# Altium project SmartBike.PrjPcb
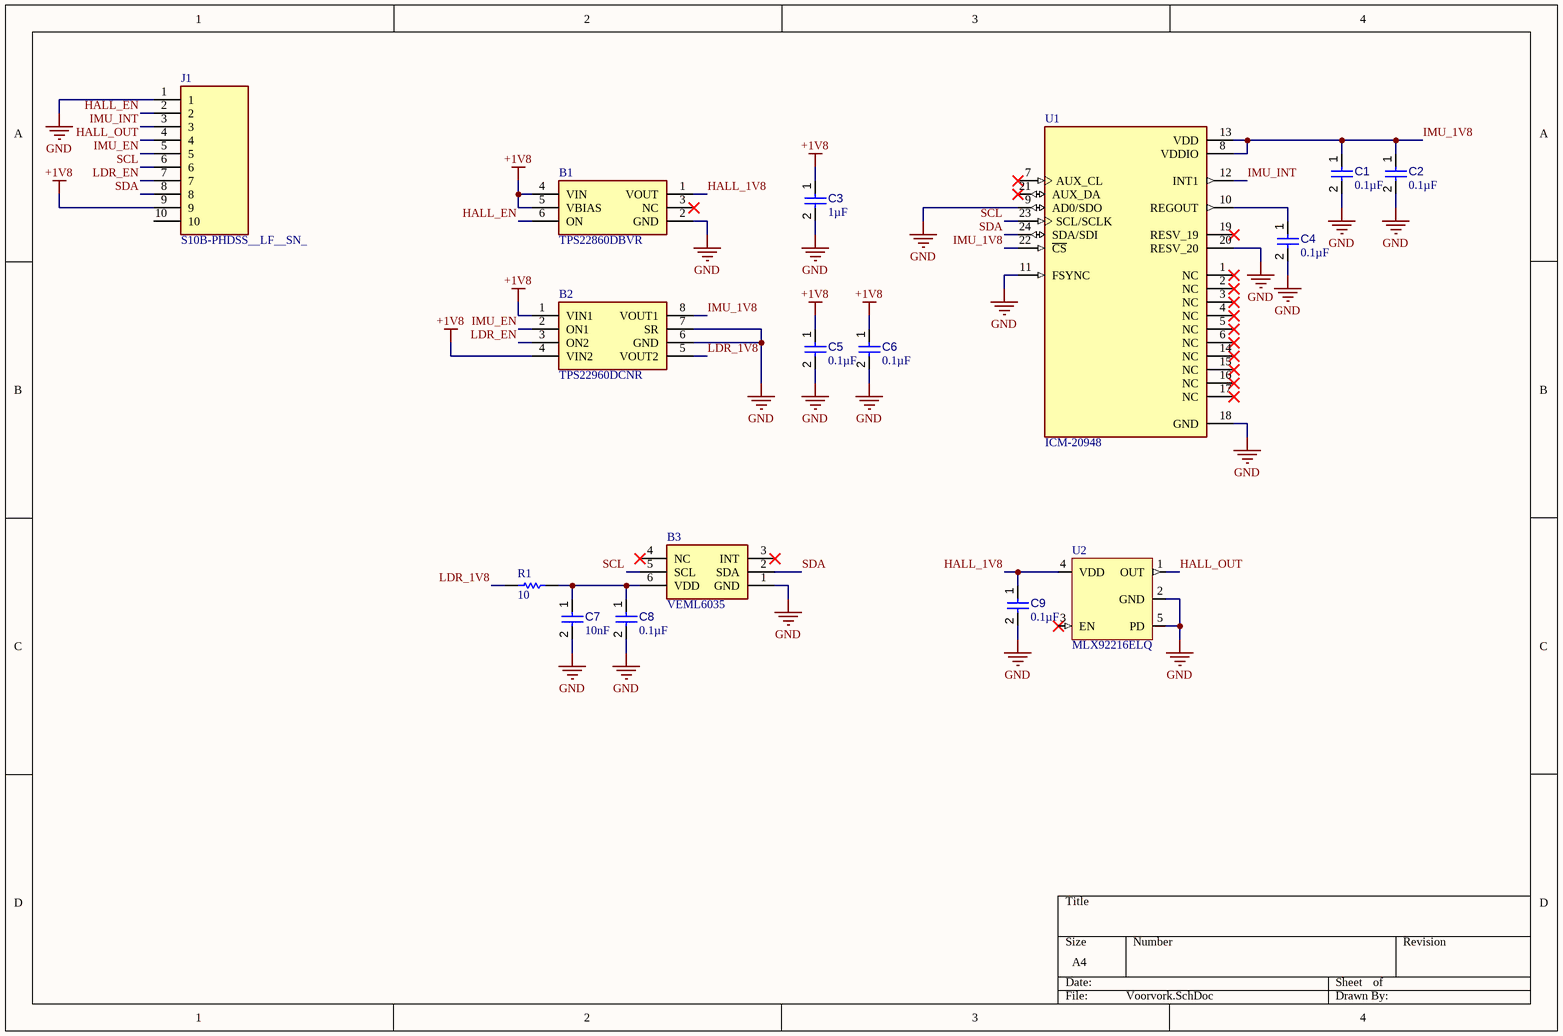
[diagram p0: Voorvork.SchDoc]
1 sheet, 16 parts. Net scope: global (net labels, ports and power ports of the same name join across sheets).
Board file: PCB1.PcbDoc

## Sheet Voorvork.SchDoc
size A4; SheetNumber: 1; SheetTotal: 1

### Parts
B1  TPS22860DBVR  [SOT95P280X145-6N]
B2  TPS22960DCNR  [SOP65P280X145-8N]
B3  VEML6035  [VEML6035]
C1  value 0.1µF  [CAPC2013X95X50LL10T25]  (hidden comment: Capacitor 100 nF +/-10% 50 V 0805)
C2  value 0.1µF  [CAPC2013X95X50LL10T25]  (hidden comment: Capacitor 100 nF +/-10% 50 V 0805)
C3  value 1µF  [CAPC2013X95X50LL10T25]  (hidden comment: Capacitor 100 nF +/-10% 50 V 0805)
C4  value 0.1µF  [CAPC2013X95X50LL10T25]  (hidden comment: Capacitor 100 nF +/-10% 50 V 0805)
C5  value 0.1µF  [CAPC2013X95X50LL10T25]  (hidden comment: Capacitor 100 nF +/-10% 50 V 0805)
C6  value 0.1µF  [CAPC2013X95X50LL10T25]  (hidden comment: Capacitor 100 nF +/-10% 50 V 0805)
C7  value 10nF  [CAPC2013X95X50LL10T25]  (hidden comment: Capacitor 100 nF +/-10% 50 V 0805)
C8  value 0.1µF  [CAPC2013X95X50LL10T25]  (hidden comment: Capacitor 100 nF +/-10% 50 V 0805)
C9  value 0.1µF  [CAPC2013X95X50LL10T25]  (hidden comment: Capacitor 100 nF +/-10% 50 V 0805)
J1  S10B-PHDSS__LF__SN_  [S10BPHDSSLFSN]
R1  value 10  [RESC2013X70X40ML20T20]  (hidden comment: Resistor 1k +/-1% 0805 125 mW)
U1  ICM-20948  [QFN40P300X300X105-24N]
U2  MLX92216ELQ  [DFN-4L]

### Nets
+1V8: B1.4(VIN) B1.5(VBIAS) B2.1(VIN1) B2.4(VIN2) C3.1 C5.1 C6.1 J1.9
GND: B1.2(GND) B2.6(GND) B2.7(SR) B3.1(GND) C1.2 C2.2 C3.2 C4.2 C5.2 C6.2 C7.2 C8.2 C9.2 J1.1 U1.9(AD0/SDO) U1.11(FSYNC) U1.18(GND) U1.20(RESV_20) U2.2(GND) U2.5(PD)
HALL_1V8: B1.1(VOUT) C9.1 U2.4(VDD)
HALL_EN: B1.6(ON) J1.2
HALL_OUT: J1.4 U2.1(OUT)
IMU_1V8: B2.8(VOUT1) C1.1 C2.1 U1.8(VDDIO) U1.13(VDD) U1.22(~{CS})
IMU_EN: B2.2(ON1) J1.5
IMU_INT: J1.3 U1.12(INT1)
LDR_1V8: B2.5(VOUT2) R1.1
LDR_EN: B2.3(ON2) J1.7
SCL: B3.5(SCL) J1.6 U1.23(SCL/SCLK)
SDA: B3.2(SDA) J1.8 U1.24(SDA/SDI)
NetB3_6: B3.6(VDD) C7.1 C8.1 R1.2
NetC4_1: C4.1 U1.10(REGOUT)

Not connected (* = marked no-connect by the designer): B1 3(NC)*; B3 3(INT)* 4(NC)*; J1 10; U1 1(NC)* 2(NC)* 3(NC)* 4(NC)* 5(NC)* 6(NC)* 7(AUX_CL)* 14(NC)* 15(NC)* 16(NC)* 17(NC)* 19(RESV_19)* 21(AUX_DA)*; U2 3(EN)*

### Library data of the parts
B1 = TPS22860DBVR: TPS22860 Ultra-low leakage load switch; Manufacturer_Name: Texas Instruments; Geometry.Height: 1.45mm; Mouser Part Number: 595-TPS22860DBVR; Mouser Price/Stock: https://www.mouser.co.uk/ProductDetail/Texas-Instruments/TPS22860DBVR?qs=UfUFg%2FkmHHGRbEQGMDY1iA%3D%3D; Manufacturer_Part_Number: TPS22860DBVR; Datasheet Link: http://www.ti.com/lit/gpn/tps22860
B2 = TPS22960DCNR: 5.5-V, 0.5-A, 435m, 2-channel load switch with quick output discharge; Manufacturer_Name: Texas Instruments; Geometry.Height: 1.45mm; Mouser Part Number: 595-TPS22960DCNR; Mouser Price/Stock: https://www.mouser.co.uk/ProductDetail/Texas-Instruments/TPS22960DCNR?qs=fvVej%2FMj3jfEFDwYBGYVGQ%3D%3D; Manufacturer_Part_Number: TPS22960DCNR; Datasheet Link: https://www.ti.com/lit/gpn/TPS22960
B3 = VEML6035: VISHAY - VEML6035 - AMBIENT LIGHT PHOTO SENSOR, I2C, SMD-6; Geometry.Height: 0.5mm; Mouser Part Number: 78-VEML6035; Mouser Price/Stock: https://www.mouser.co.uk/ProductDetail/Vishay-Semiconductors/VEML6035?qs=u16ybLDytRbGlqopHyj3nQ%3D%3D; Manufacturer_Name: Vishay; Manufacturer_Part_Number: VEML6035; Datasheet Link: https://www.vishay.com/docs/84889/veml6035.pdf
C1-C9 = CMP-001-00018-6: Chip Capacitor, 100 nF, +/- 10%, 50 V, 0805 (2012 Metric); Capacitor Type: Ceramic; Voltage Rating: 50V; Pins: 2; Max Operating Temperature: 125°C; Min Operating Temperature: -55°C; Mounting Technology: SM; Case/Package: 0805; RoHS Compliant: True; Tolerance: 10%
J1 = S10B-PHDSS__LF__SN_: Connector Header Through Hole, Right Angle 10 position 0.079" (2.00mm); Manufacturer_Name: JST (JAPAN SOLDERLESS TERMINALS); Manufacturer_Part_Number: S10B-PHDSS (LF)(SN); Geometry.Height: 5mm; Farnell Part Number: *; Farnell Price/Stock: *; Datasheet Link: https://www.jst-mfg.com/product/pdf/eng/ePHD.pdf
R1 = CMP-009-00010-5: Chip Resistor, 1 KOhm, +/- 1%, 0.125 W, -55 to 155 degC, 0805 (2013 Metric); Power: 125mW; Voltage Rating: 150V; Tolerance: 1%; RoHS Compliant: True; Mounting Technology: SM; Pins: 2; Case/Package: 0805; Max Operating Temperature: 155°C; Min Operating Temperature: -55°C
U1 = CMP-006-000000-1: Accelerometer, Gyroscope, Magnetometer, 9 Axis Sensor I2C, SPI Output; MF: TDK InvenSense; Design Item ID: ICM-20948; Check_prices: https://www.snapeda.com/parts/ICM-20948/TDK/view-part/?ref=eda; MP: ICM-20948; SnapEDA_Link: https://www.snapeda.com/parts/ICM-20948/TDK/view-part/?ref=snap; Source: ICM-20948.SchLib; Pin Count: 24; Package: TFQFN-24 TDK InvenSense; Value: *; Component Type: Standard